# Altium schematic sheet Thermocouple Channel.SchDoc
size A
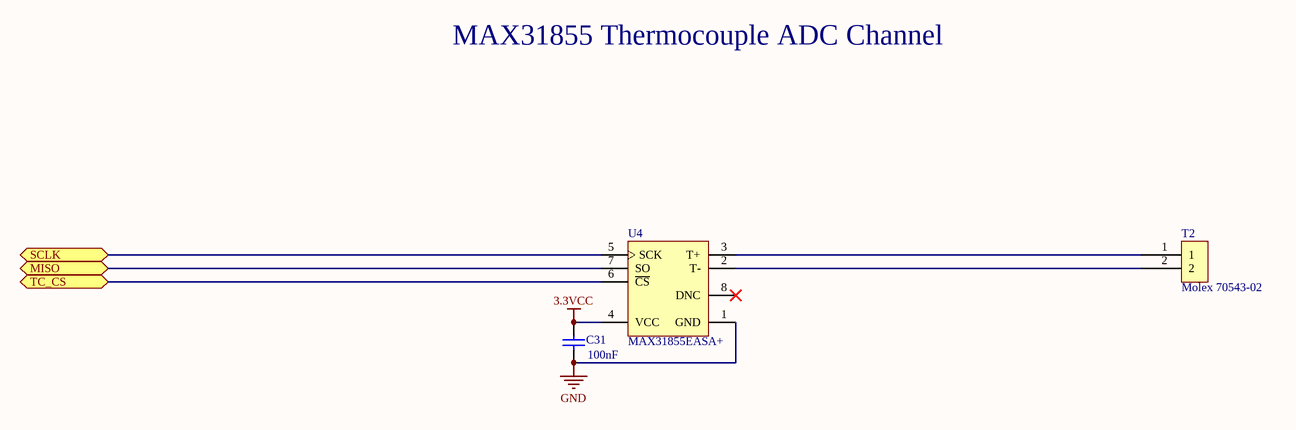
[diagram p0: Thermocouple Channel.SchDoc]

## Parts
C31  value 100nF  [1608[0603]]  (hidden comment: Cap Semi)
T2  Molex 70543-02  [70543-02]
U4  MAX31855EASA+  [MAXM-S8+4_N]

## Ports
MISO, SCLK, TC_CS

## Nets
3.3VCC: C31.2 U4.4(VCC)
GND: C31.1 U4.1(GND)
MISO: U4.7(SO) ; port MISO
SCLK: U4.5(SCK) ; port SCLK
TC_CS: U4.6(~{CS}) ; port TC_CS
NetT2_1: T2.1 U4.3(T+)
NetT2_2: T2.2 U4.2(T-)

Not connected (* = marked no-connect by the designer): U4 8(DNC)*

## Notes on the sheet
- MAX31855 Thermocouple ADC Channel

## Library data of the parts
C31 = Cap Semi: Capacitor (Semiconductor SIM Model); Published: 8-Jun-2000; LatestRevisionDate: 29-May-2009; LatestRevisionNote: IPC-7351 Footprint Added.; PackageReference: C1206; Publisher: Altium Limited; PackageDescription: Chip Capacitor
U4 = MAX31855EASA+: Cold Junction Compensated Thermocouple to Digital Converter, 14 Bits Temperature Resolution, -40 to 125 degC, 8-Pin SOIC (S8+4), Pb-Free; Functions: Thermocouple-to-Digital Converter; Interface: SPI; Parasite Pwr.: No; DatasheetVersion: Rev. 2; PackageVersion: Rev. D, 10/2012; PackageReference: S8+4; PackageDescription: 8-Pin Small-Outline IC, Narrow, Body 3.9 x 4.9 mm, Pitch 1.27 mm; Supplier 1: Digi-Key; Supplier Part Number 1: MAX31855EASA+-ND; Supplier 2: Mouser; Supplier Part Number 2: 700-MAX31855EASA+; Generic Part Number: MAX31855; Mounting Technology: Surface Mount; Code_JEDEC: MS-012; PartNumber: MAX31855EASA+; ComponentLink1Description: Manufacturer URL; ComponentLink1URL: http://www.maximintegrated.com/; ComponentLink2Description: Datasheet; ComponentLink2URL: http://datasheets.maximintegrated.com/en/ds/MAX31855.pdf; ComponentLink3Description: Package Specification; ComponentLink3URL: http://pdfserv.maximintegrated.com/package_dwgs/21-0041.PDF